# EAGLE design Board-Front (EAGLE 9.0.1)
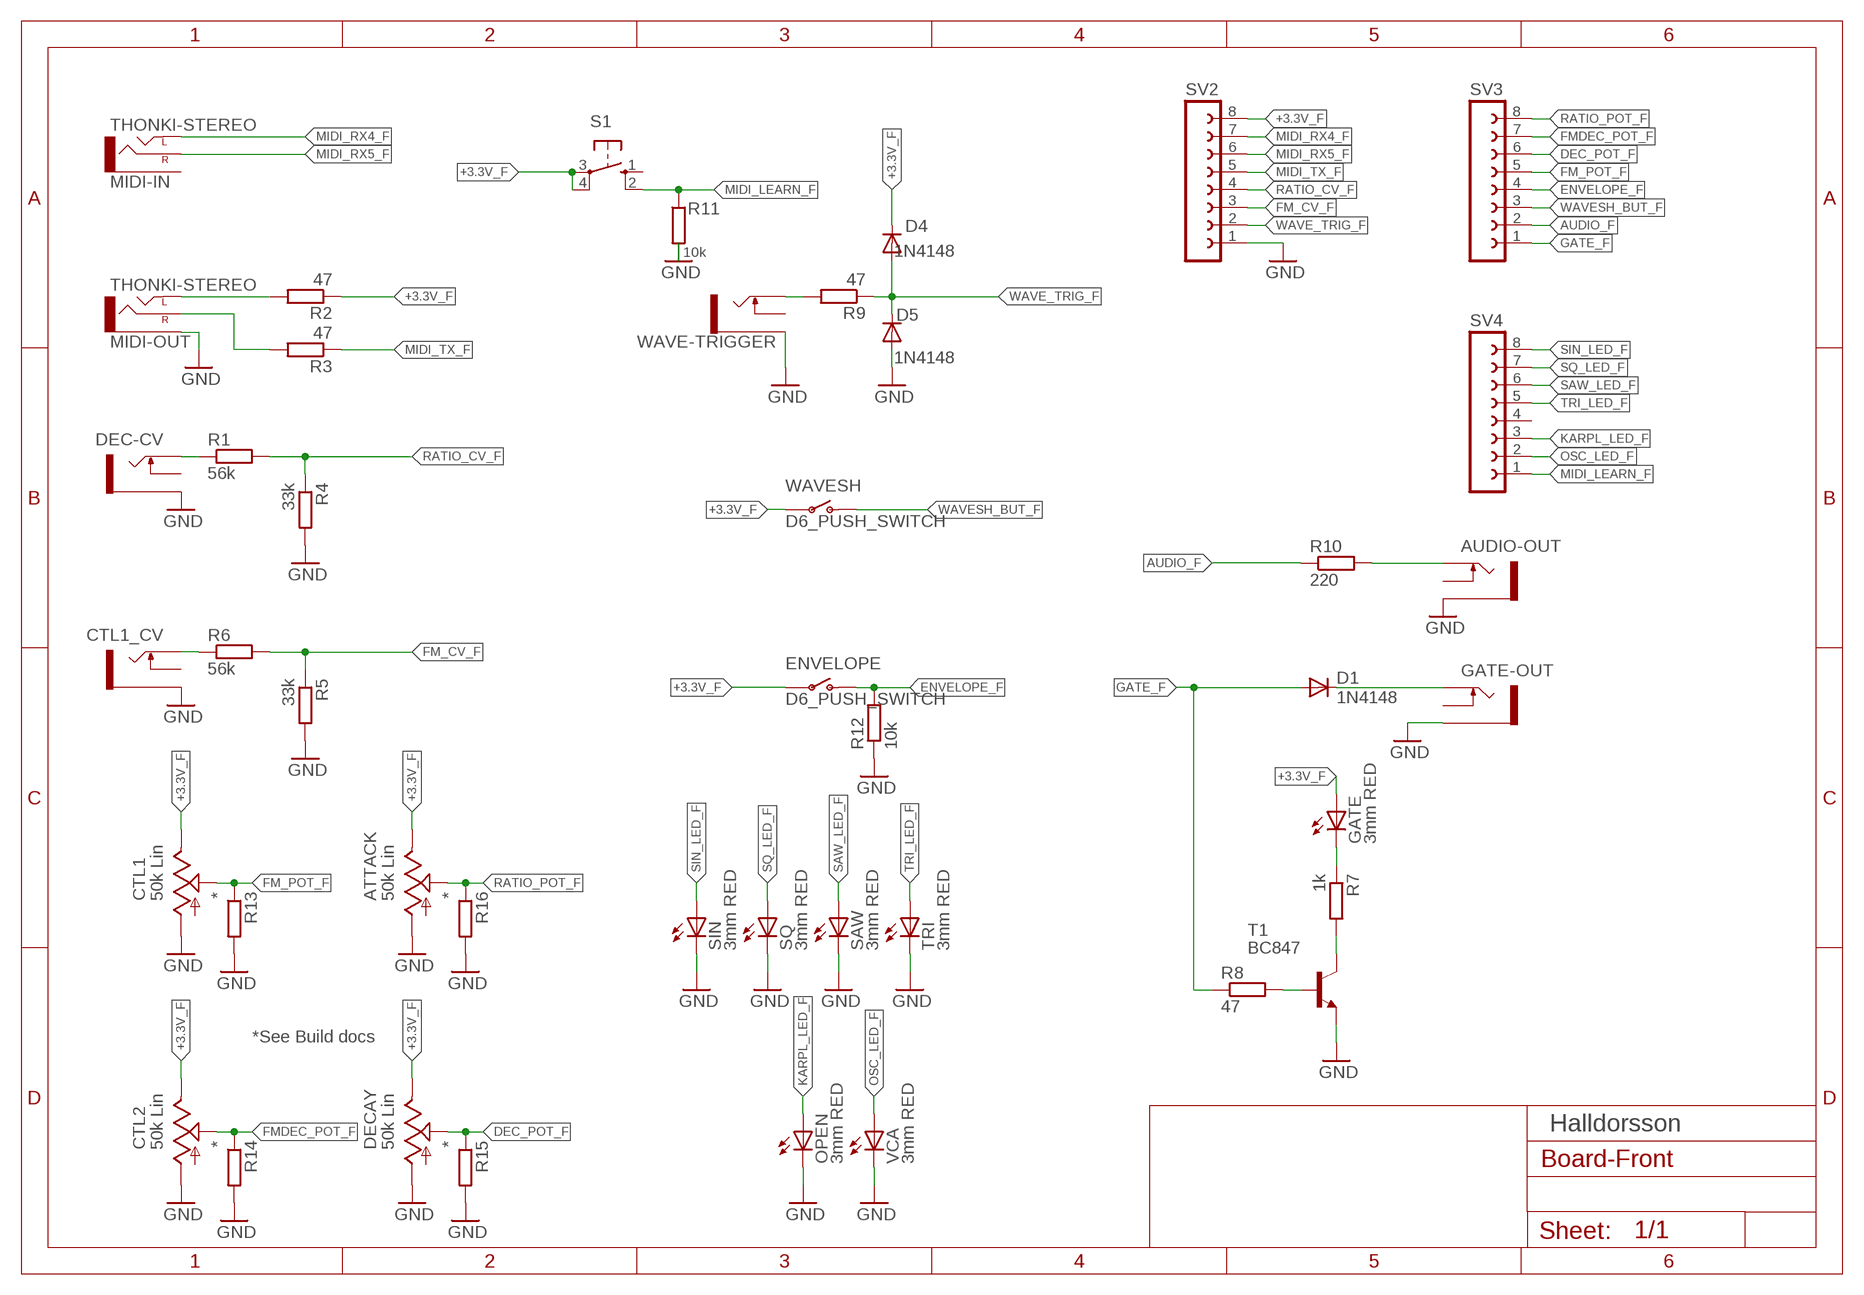
[diagram p0: schematic, sheet 1]

## Parts
ATTACK  50k Lin  9MM_SNAP-IN_POT_  [9MM_SNAP-IN_POT]
AUDIO-OUT  THONKICONNNEW  [WQP-PJ301M-12_JACK]
CTL1  50k Lin  9MM_SNAP-IN_POT_  [9MM_SNAP-IN_POT]
CTL1_CV  THONKICONNNEW  [WQP-PJ301M-12_JACK]
CTL2  50k Lin  9MM_SNAP-IN_POT_  [9MM_SNAP-IN_POT]
D1  1N4148  1N4148DO35-7  [DO35-7]
D4  1N4148  1N4148DO35-7  [DO35-7]
D5  1N4148  1N4148DO35-7  [DO35-7]
DEC-CV  THONKICONNNEW  [WQP-PJ301M-12_JACK]
DECAY  50k Lin  9MM_SNAP-IN_POT_  [9MM_SNAP-IN_POT]
ENVELOPE  D6_PUSH_SWITCH  [D6_PUSH_SWITCH]
GATE  3mm RED  LED3MM  [LED3MM]
GATE-OUT  THONKICONNNEW  [WQP-PJ301M-12_JACK]
MIDI-IN  THONKI-STEREO  [WQP-PJ366ST_JACK]
MIDI-OUT  THONKI-STEREO  [WQP-PJ366ST_JACK]
OPEN  3mm RED  LED3MM  [LED3MM]
R1  56k  R-EU_M1206  [M1206]
R2  47  R-EU_M1206  [M1206]
R3  47  R-EU_M1206  [M1206]
R4  33k  R-EU_M1206  [M1206]
R5  33k  R-EU_M1206  [M1206]
R6  56k  R-EU_M1206  [M1206]
R7  1k  R-EU_M1206  [M1206]
R8  47  R-EU_M1206  [M1206]
R9  47  R-EU_M1206  [M1206]
R10  220  R-EU_M1206  [M1206]
R11  10k  R-EU_M1206  [M1206]
R12  10k  R-EU_M1206  [M1206]
R13  *  R-EU_M1206  [M1206]
R14  *  R-EU_M1206  [M1206]
R15  *  R-EU_M1206  [M1206]
R16  *  R-EU_M1206  [M1206]
S1  10-XX  [B3F-10XX]
SAW  3mm RED  LED3MM  [LED3MM]
SIN  3mm RED  LED3MM  [LED3MM]
SQ  3mm RED  LED3MM  [LED3MM]
SV2  FE08-1  [FE08]
SV3  FE08-1  [FE08]
SV4  FE08-1  [FE08]
T1  BC847  [SOT23]
TRI  3mm RED  LED3MM  [LED3MM]
VCA  3mm RED  LED3MM  [LED3MM]
WAVE-TRIGGER  THONKICONNNEW  [WQP-PJ301M-12_JACK]
WAVESH  D6_PUSH_SWITCH  [D6_PUSH_SWITCH]

## Nets
+3.3V_F: ATTACK.3(E) CTL1.3(E) CTL2.3(E) D4.C DECAY.3(E) ENVELOPE.P$3(P) ENVELOPE.P$4(P) GATE.A R2.1 S1.3(P) S1.4(P1) SV2.8 WAVESH.P$3(P) WAVESH.P$4(P)
AUDIO_F: R10.1 SV3.2
B: R8.2 T1.1(B)
C: R7.2 T1.3(C)
DEC_POT_F: DECAY.2(S) R15.1 SV3.6
ENVELOPE_F: ENVELOPE.P$1(O) ENVELOPE.P$2(O) R12.2 SV3.4
FM_CV_F: R5.1 R6.2 SV2.3
FM_POT_F: CTL1.2(S) R13.1 SV3.5
FMDEC_POT_F: CTL2.2(S) R14.1 SV3.7
GATE_F: D1.A R8.1 SV3.1
GND: ATTACK.1(A) AUDIO-OUT.P$3_SLEEVE(SLEEVE) CTL1.1(A) CTL1_CV.P$3_SLEEVE(SLEEVE) CTL2.1(A) D5.A DEC-CV.P$3_SLEEVE(SLEEVE) DECAY.1(A) GATE-OUT.P$3_SLEEVE(SLEEVE) MIDI-OUT.P$3_SLEEVE(SLEEVE) OPEN.K(C) R4.2 R5.2 R11.2 R12.1 R13.2 R14.2 R15.2 R16.2 SAW.K(C) SIN.K(C) SQ.K(C) SV2.1 T1.2(E) TRI.K(C) VCA.K(C) WAVE-TRIGGER.P$3_SLEEVE(SLEEVE)
KARPL_LED_F: OPEN.A SV4.3
MIDI_LEARN_F: R11.1 S1.2(S1) SV4.1
MIDI_RX4_F: MIDI-IN.P$1_TIP(LEFT) SV2.7
MIDI_RX5_F: MIDI-IN.P$2_SWITCH(RIGHT) SV2.6
MIDI_TX_F: R3.1 SV2.5
N$1: DEC-CV.P$1_TIP(TIP) R1.1
N$2: GATE.K(C) R7.1
N$3: D1.C GATE-OUT.P$1_TIP(TIP)
N$4: CTL1_CV.P$1_TIP(TIP) R6.1
N$5: AUDIO-OUT.P$1_TIP(TIP) R10.2
N$6: MIDI-OUT.P$2_SWITCH(RIGHT) R3.2
N$7: MIDI-OUT.P$1_TIP(LEFT) R2.2
N$9: R9.2 WAVE-TRIGGER.P$1_TIP(TIP)
OSC_LED_F: SV4.2 VCA.A
RATIO_CV_F: R1.2 R4.1 SV2.4
RATIO_POT_F: ATTACK.2(S) R16.1 SV3.8
SAW_LED_F: SAW.A SV4.6
SIN_LED_F: SIN.A SV4.8
SQ_LED_F: SQ.A SV4.7
TRI_LED_F: SV4.5 TRI.A
WAVE_TRIG_F: D4.A D5.C R9.1 SV2.2
WAVESH_BUT_F: SV3.3 WAVESH.P$1(O) WAVESH.P$2(O)
Unconnected: AUDIO-OUT.P$2_SWITCH(SWITCH) CTL1_CV.P$2_SWITCH(SWITCH) DEC-CV.P$2_SWITCH(SWITCH) GATE-OUT.P$2_SWITCH(SWITCH) MIDI-IN.P$3_SLEEVE(SLEEVE) S1.1(S) SV4.4 WAVE-TRIGGER.P$2_SWITCH(SWITCH)

## Notes on the sheet
- *See Build docs
- Halldorsson

## Library data of the parts
ATTACK CTL1 CTL2 DECAY = MusicThingModular:9MM_SNAP-IN_POT: 9mm vertical snap-in pot, Alpha / Panasonic style
AUDIO-OUT CTL1_CV DEC-CV GATE-OUT WAVE-TRIGGER = MusicThingModular:THONKICONN: 3.5mm socket for Eurorack modular synths
D1 D4 D5 = diode:1N4148: DIODE high speed (Philips)
ENVELOPE WAVESH = MusicThingModular:D6_PUSH_SWITCH: Push switch
GATE OPEN SAW SIN SQ TRI VCA = led:LED: LED OSRAM: - CHIPLED LG R971, LG N971, LY N971, LG Q971, LY Q971, LO R971, LY R971 LH N974, LH R974 LS Q976, LO Q976, LY Q976 LO Q996 - Hyper CHIPLED LW Q18S LB Q993, LB Q99A, LB R99A - SideLED LS A670, LO A670, LY A670, LG A670, LP A670 LB A673, LV A673, LT A673, LW A673 LH A674 LY A675 LS A676, LA A676, LO A676, LY A676, LW A676 LS A679, LY A679, LG A679 - Hyper Micro SIDELED® LS Y876, LA Y876, LO Y876, LY Y876 LT Y87S - SmartLED LW L88C, LW L88S LB L89C, LB L89S, LG L890 LS L89K, LO L89K, LY L89K LS L896, LA L896, LO L896, LY L896 - TOPLED LS T670, LO T670, LY T670, LG T670, LP T670 LSG T670, LSP T670, LSY T670, LOP T670, LYG T670 LG T671, LOG T671, LSG T671 LB T673, LV T673, LT T673, LW T673 LH T674 LS T676, LA T676, LO T676, LY T676, LB T676, LH T676, LSB T676, LW T676 LB T67C, LV T67C, LT T67C, LS T67K, LO T67K, LY T67K, LW E67C LS E67B, LA E67B, LO E67B, LY E67B, LB E67C, LV E67C, LT E67C LW T67C LS T679, LY T679, LG T679 LS T770, LO T770, LY T770, LG T770, LP T770 LB T773, LV T773, LT T773, LW T773 LH T774 LS E675, LA E675, LY E675, LS T675 LS T776, LA T776, LO T776, LY T776, LB T776 LHGB T686 LT T68C, LB T68C - Hyper Mini TOPLED® LB M676 - Mini TOPLED Santana® LG M470 LS M47K, LO M47K, LY M47K Source: http://www.osram.convergy.de LUXEON: - LUMILED® LXK2-PW12-R00, LXK2-PW12-S00, LXK2-PW14-U00, LXK2-PW14-V00 LXK2-PM12-R00, LXK2-PM12-S00, LXK2-PM14-U00 LXK2-PE12-Q00, LXK2-PE12-R00, LXK2-PE12-S00, LXK2-PE14-T00, LXK2-PE14-U00 LXK2-PB12-K00, LXK2-PB12-L00, LXK2-PB12-M00, LXK2-PB14-N00, LXK2-PB14-P00, LXK2-PB14-Q00 LXK2-PR12-L00, LXK2-PR12-M00, LXK2-PR14-Q00, LXK2-PR14-R00 LXK2-PD12-Q00, LXK2-PD12-R00, LXK2-PD12-S00 LXK2-PH12-R00, LXK2-PH12-S00 LXK2-PL12-P00, LXK2-PL12-Q00, LXK2-PL12-R00 Source: www.luxeon.com KINGBRIGHT: KA-3528ASYC Source: www.kingbright.com
MIDI-IN MIDI-OUT = MusicThingModular:THONKI-STEREO: 3.5mm socket for Eurorack modular synths
R1-R16 = resistor:R-EU_: RESISTOR, European symbol
S1 = switch-omron:10-XX: OMRON SWITCH; MPN: B3F-1000; OC_FARNELL: 176432; OC_NEWARK: 36M3542
SV2-SV4 = con-lsta:FE08-1: FEMALE HEADER; OC_FARNELL: unknown; OC_NEWARK: unknown
T1 = transistor:BC847: NPN TRANSISTOR

## Board
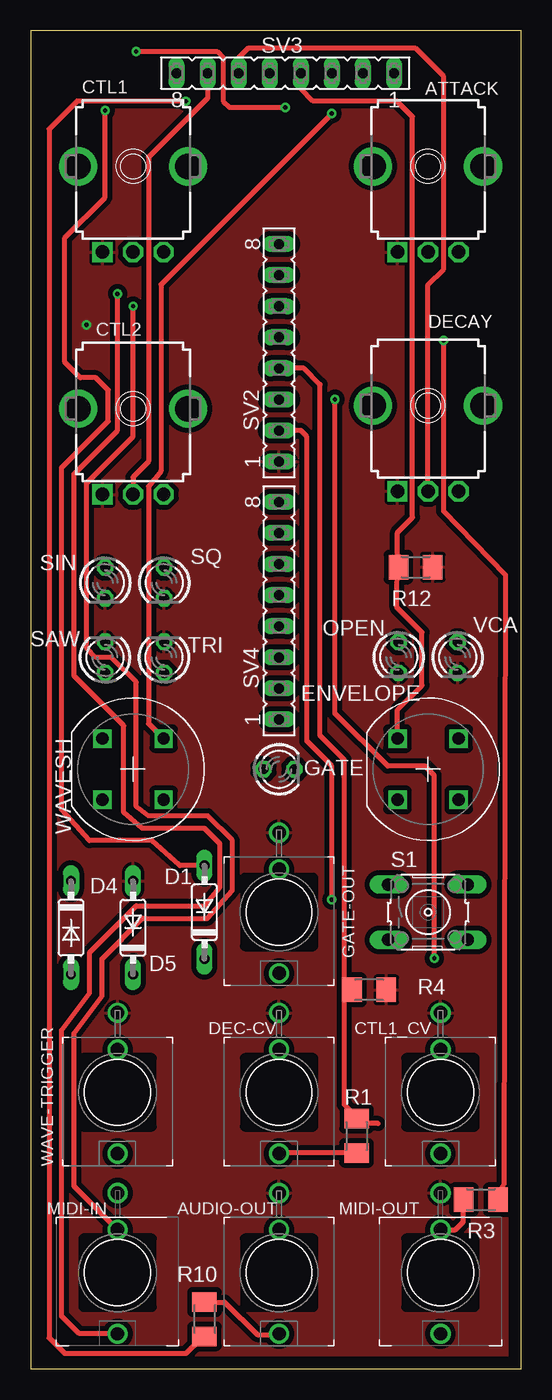
[diagram p1: board, top side]
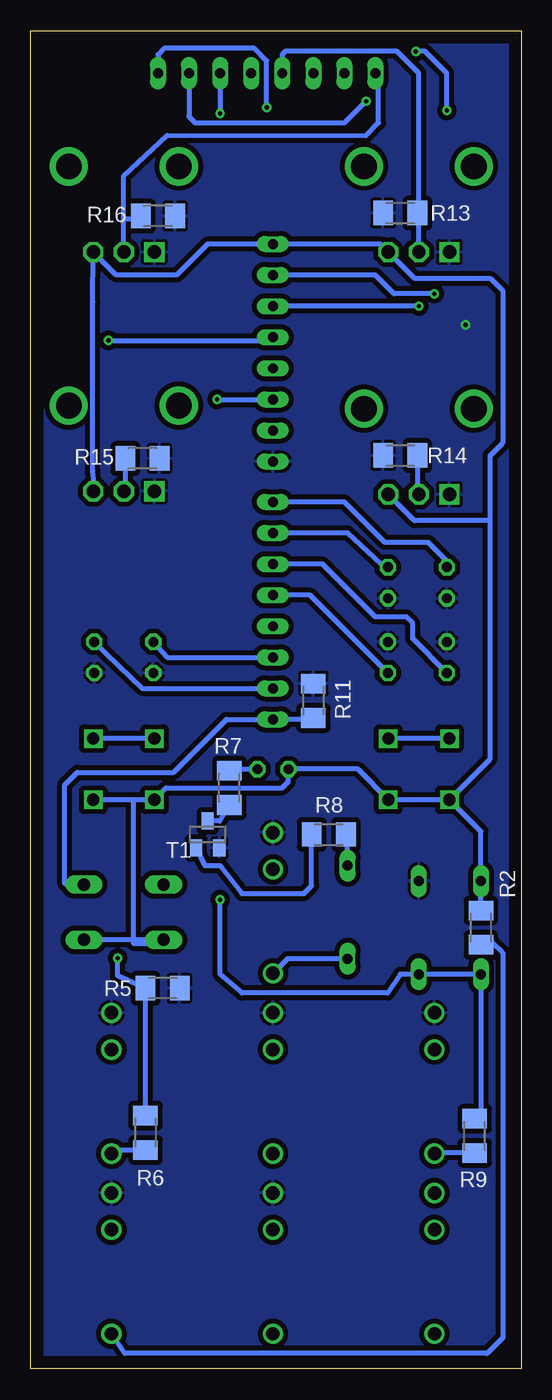
[diagram p2: board, bottom side, seen from below]

Size 40.14 x 109.4 mm. Coordinates in mm from the lower left corner, seen from the top.
Outline: 0,109.4 0,0 40.14,0 40.14,109.4 0,109.4
Copper layers (1*16): Top 0.035mm / dielectric 1.5mm / Bottom 0.035mm
Design rules "default": minimum track width 6mil, minimum drill 0.35mm, track to track 6mil, track to pad 6mil, pad to pad 6mil, via to via 6mil, smd to smd 6mil, copper to edge 40mil, drill to drill 6mil, minimum pad ring 10mil, minimum via ring 8mil, stop-mask expansion 4mil, vias tented up to drill 0mil, thermal gap 10mil

### Footprints (pad centres in the part's own frame; a part is rotated, then mirrored left to right if it is on the bottom)
9MM_SNAP-IN_POT = drill 1.1 square: 1 -2.5,-7 | drill 1.1 octagon: 2 0,-7; 3 2.5,-7 | drill 2.1 pad 2.794: CHASSIS1 -4.5,0; CHASSIS2 4.5,0
WQP-PJ301M-12_JACK = drill 1.1: P$1_TIP 0,5; P$2_SWITCH 0,-3.5; P$3_SLEEVE 0,-6.5
DO35-7 = drill 0.813 long: A 3.81,0; C -3.81,0
D6_PUSH_SWITCH = drill 1 square: P$1 -2.5,2.5; P$2 2.5,2.5; P$3 2.5,-2.5; P$4 -2.5,-2.5
LED3MM = drill 0.813 octagon: A -1.27,0; K 1.27,0
WQP-PJ366ST_JACK = drill 1.1: P$1_TIP 0,5; P$2_SWITCH 0,-3.5; P$3_SLEEVE 0,-6.5
M1206 = smd 1.6 x 2: 1 -1.4,0; 2 1.4,0
B3F-10XX = drill 1.016 long: 1 -3.251,2.261; 2 3.251,2.261; 3 -3.251,-2.261; 4 3.251,-2.261
FE08 = drill 0.813 long: 1 -8.89,0; 2 -6.35,0; 3 -3.81,0; 4 -1.27,0; 5 1.27,0; 6 3.81,0; 7 6.35,0; 8 8.89,0
SOT23 = smd 1 x 1.4: 1 -0.95,-1.1; 2 0.95,-1.1; 3 0,1.1

### Placement (x,y rotation side)
ATTACK  32.51,98.3 0 top
AUDIO-OUT  20.32,7.87 180 top
CTL1  8.38,98.3 0 top
CTL1_CV  33.53,22.61 180 top
CTL2  8.38,78.49 0 top
D1  14.22,37.34 90 top
D4  3.3,36.07 270 top
D5  8.38,36.07 90 top
DEC-CV  20.32,22.61 180 top
DECAY  32.51,78.74 0 top
ENVELOPE  32.51,49.02 0 top
GATE  20.32,49.02 0 top
GATE-OUT  20.32,37.34 180 top
MIDI-IN  7.11,7.87 180 top
MIDI-OUT  33.53,7.87 180 top
OPEN  30.1,58.17 270 top
R1  26.67,19.05 90 top
R2  3.3,36.07 270 bottom
R3  36.83,13.84 180 top
R4  27.69,30.99 0 top
R5  29.34,31.11 0 bottom
R6  30.73,19.3 90 bottom
R7  23.88,47.5 270 bottom
R8  15.75,43.69 180 bottom
R9  3.81,19.05 270 bottom
R10  14.22,4.06 90 top
R11  17.02,54.61 90 bottom
R12  31.5,65.53 180 top
R13  9.91,94.49 180 bottom
R14  9.91,74.68 180 bottom
R15  30.99,74.42 0 bottom
R16  29.72,94.23 0 bottom
S1  32.51,37.34 0 top
SAW  6.1,58.17 90 top
SIN  6.1,64.26 270 top
SQ  10.92,64.26 270 top
SV2  20.32,83.06 90 top
SV3  20.83,105.92 180 top
SV4  20.32,61.98 90 top
T1  25.65,43.69 0 bottom
TRI  10.92,58.17 90 top
VCA  34.92,58.17 270 top
WAVE-TRIGGER  7.11,22.61 180 top
WAVESH  8.38,49.02 0 top

### Tracks (layer width: path | path; a pad name or v marks a point on that pad's centre or on a via)
+3.3V_F
  Bottom 0.406: WAVESH.P$4 3.3,43.94 D4.C R2.1 | 10.88,46.44 WAVESH.P$3 | WAVESH.P$3 13.38,49.02 GATE.A 19.05,48.01 19.56,47.5 29.04,47.5 ENVELOPE.P$4 | ENVELOPE.P$4 ENVELOPE.P$3 | WAVESH.P$4 2.54,49.86 2.54,69.34 | 2.54,69.34 2.54,74.68 1.52,75.69 1.52,88.14 2.54,89.15 8.74,89.15 CTL1.3 11.53,91.95 SV2.8 25.65,91.95 28.19,89.41 33.12,89.41 ATTACK.3 35.05,87.19 35.05,73.41 34.91,71.99 DECAY.3 | 2.54,69.34 8.74,69.34 CTL2.3 | WAVESH.P$4 WAVESH.P$3 | ENVELOPE.P$4 31.75,46.48 31.75,34.8 30.5,34.8 | 29.21,34.8 30.5,34.8 | 30.5,34.8 S1.3 S1.4
AUDIO_F  (via drill 0.35)
  Top 0.406: v12.7,103.63 3.81,103.63 1.52,101.35 1.52,2.54 2.79,1.27 12.7,1.27 13.21,1.78 13.72,2.16 R10.1
  Bottom 0.406: SV3.2 27.18,102.36 26.67,101.85 14.48,101.85 v12.7,103.63
B
  Bottom 0.406: T1.1 26.6,42.61 25.91,41.15 24.64,41.15 22.86,38.86 17.78,38.86 17.15,39.49 R8.2
C
  Bottom 0.406: R7.2 24.68,44.79 T1.3
DEC_POT_F
  Top 0.406: DECAY.2 32.51,88.65 33.78,89.92 33.78,105.66 31.5,107.95 17.78,107.95 17.02,107.19 SV3.6
  Bottom 0.406: R15.1 32.39,71.86 DECAY.2
ENVELOPE_F
  Top 0.406: ENVELOPE.P$1 30.01,53.89 32,55.88 32,60.2 29.97,62.23 30,66.55 | 30,66.55 30.01,68.37 31.24,69.6 31.24,102.36 29.97,103.63 23.11,103.63 22.1,104.65 SV3.4 | R12.2 30.1,66.45 30,66.55
  Bottom 0.406: ENVELOPE.P$1 ENVELOPE.P$2
FM_CV_F  (via drill 0.35)
  Top 0.406: v24.89,79.25 24.89,53.59 29.21,49.28 32.26,49.28 33.02,48.51 v33.02,33.58
  Bottom 0.406: v24.89,79.25 SV2.3 | R6.2 R5.1 33.02,32.13 v33.02,33.58
FM_POT_F
  Bottom 0.406: CTL1.2 8.38,94.23 | 8.38,94.23 8.38,105.92 10.16,107.7 19.3,107.7 19.56,107.44 SV3.5 | R13.1 8.51,94.36 8.38,94.23
FMDEC_POT_F
  Top 0.406: SV3.7 14.48,103.89 9.65,99.06 9.65,74.17 8.38,72.9 CTL2.2
  Bottom 0.406: R14.1 8.51,71.61 CTL2.2
GATE_F  (via drill 0.35)
  Top 0.406: D1.A 12.19,41.15 9.91,43.18 4.83,43.18 2.54,45.72 2.54,73.66 6.35,77.47 6.35,80.01 5.33,81.03 4.06,81.03 2.79,82.3 2.79,92.46 6.1,95.76 v6.1,102.87 | v8.64,107.7 15.24,107.7 15.75,107.19 15.75,103.63 16.26,103.12 v20.83,103.12
  Bottom 0.406: D1.A 14.22,43.69 R8.1 | v6.1,102.87 6.1,105.92 7.87,107.7 v8.64,107.7 | v20.83,103.12 20.83,106.93 21.84,107.95 29.21,107.95 29.72,107.44 SV3.1
GND  (via drill 0.35)
  other vias: 4.57,85.34
  pour Top (isolate 0.406): 0.25,109.22 40.39,109.22 40.13,-0.25 0,-0.25
  pour Bottom (isolate 0.406): -0.25,108.97 39.62,108.97 39.62,-1.02 -0.25,-1.02
KARPL_LED_F
  Bottom 0.406: OPEN.A 28.96,58.17 SV4.3
MIDI_LEARN_F
  Bottom 0.406: R11.1 16.39,53.22 17.27,53.09 SV4.1 24.13,53.09 28.45,48.77 36.32,48.77 37.34,47.75 37.34,39.65 35.81,39.65 S1.2
MIDI_RX4_F  (via drill 0.35)
  Top 0.406: MIDI-IN.P$1_TIP 3.98,2.87 2.54,4.32 2.54,27.69 4.83,30.73 4.83,34.04 8.64,37.85 14.22,37.85 15.49,39.37 15.49,42.93 14.22,44.2 9.14,44.2 7.62,45.47 7.62,52.58 3.56,56.64 3.56,73.15 7.11,76.71 v7.11,87.88
  Bottom 0.406: v7.11,87.88 10.41,87.88 11.94,89.41 SV2.7
MIDI_RX5_F  (via drill 0.35)
  Top 0.406: MIDI-IN.P$2_SWITCH 3.56,14.93 3.56,27.43 5.84,30.48 5.84,33.53 9.14,36.83 14.48,36.83 16.51,39.12 16.51,43.18 14.48,45.21 9.65,45.21 8.64,45.97 8.64,56.13 6.6,58.17 5.33,58.17 4.57,58.93 4.57,72.39 8.38,76.2 v8.38,86.87
  Bottom 0.406: v8.38,86.87 SV2.6
MIDI_TX_F  (via drill 0.35)
  Top 0.406: v33.78,84.07 33.78,70.1 38.86,64.9 38.73,15.11 38.48,14.73 R3.1
  Bottom 0.406: v33.78,84.07 20.57,84.07 SV2.5
N$1
  Top 0.406: R1.1 20.36,17.65 DEC-CV.P$1_TIP
N$2
  Bottom 0.406: R7.1 23.24,49.02 GATE.K
N$3
  Bottom 0.406: 14.3,33.61 D1.C 19.13,33.53 GATE-OUT.P$1_TIP
N$4
  Bottom 0.406: CTL1_CV.P$1_TIP 33.23,17.9 R6.1
N$5
  Top 0.406: AUDIO-OUT.P$1_TIP 20.28,2.92 20.15,2.79 18.54,2.79 15.87,5.46 R10.2
N$6
  Top 0.406: MIDI-OUT.P$2_SWITCH 34.74,11.37 35.38,12.01 35.38,13.79 R3.2
  Bottom 0.406: 33.65,11.37 MIDI-OUT.P$2_SWITCH
N$7
  Bottom 0.406: R2.2 2.41,34.92 1.52,34.04 1.52,2.54 2.79,1.27 32.43,1.27 MIDI-OUT.P$1_TIP
N$9
  Bottom 0.406: R9.2 7.11,17.65 WAVE-TRIGGER.P$1_TIP
OSC_LED_F
  Bottom 0.406: VCA.A 30.99,55.63 SV4.2
RATIO_CV_F
  Top 0.152: R4.1 25.78,30.48 25.65,30.48
  Top 0.406: SV2.4 22.35,81.79 23.67,80.47 23.67,51.77 25.65,49.78 25.65,30.48 25.65,21.59 26.67,20.57 | 26.67,20.57 R1.2 | 28.45,20.07 27.18,20.07 26.67,20.57
RATIO_POT_F
  Bottom 0.406: ATTACK.2 32.51,93.98 | 32.51,93.98 32.51,97.54 28.96,100.84 12.71,100.82 11.68,101.86 11.68,105.66 SV3.8 | R16.1 31.37,93.98 32.51,93.98
SAW_LED_F
  Bottom 0.406: SAW.A 8.89,59.69 8.89,60.96 9.4,61.47 11.94,61.47 16.26,65.79 SV4.6
SIN_LED_F
  Bottom 0.406: SIN.A 6.1,66.04 7.62,67.56 11.18,67.56 14.48,70.87 SV4.8
SQ_LED_F
  Bottom 0.406: SQ.A 10.92,65.28 14.22,68.33 SV4.7
TRI_LED_F
  Bottom 0.406: SV4.5 17.27,63.25 TRI.A
WAVE_TRIG_F  (via drill 0.35)
  Top 0.406: v24.64,38.35 24.64,49.28 22.61,51.31 22.61,76.2 22.1,76.71 SV2.2
  Bottom 0.406: R9.1 3.3,20.45 D4.A D5.C 9.91,32.26 10.92,30.73 22.86,30.73 24.64,32.26 v24.64,38.35
WAVESH_BUT_F  (via drill 0.35)
  Top 0.406: v24.64,102.62 10.67,88.65 10.67,73.41 9.65,72.14 9.65,52.75 WAVESH.P$2
  Bottom 0.406: WAVESH.P$1 WAVESH.P$2 | SV3.3 v24.64,102.62